# EAGLE design DoorLockShield (EAGLE 9.4.2)
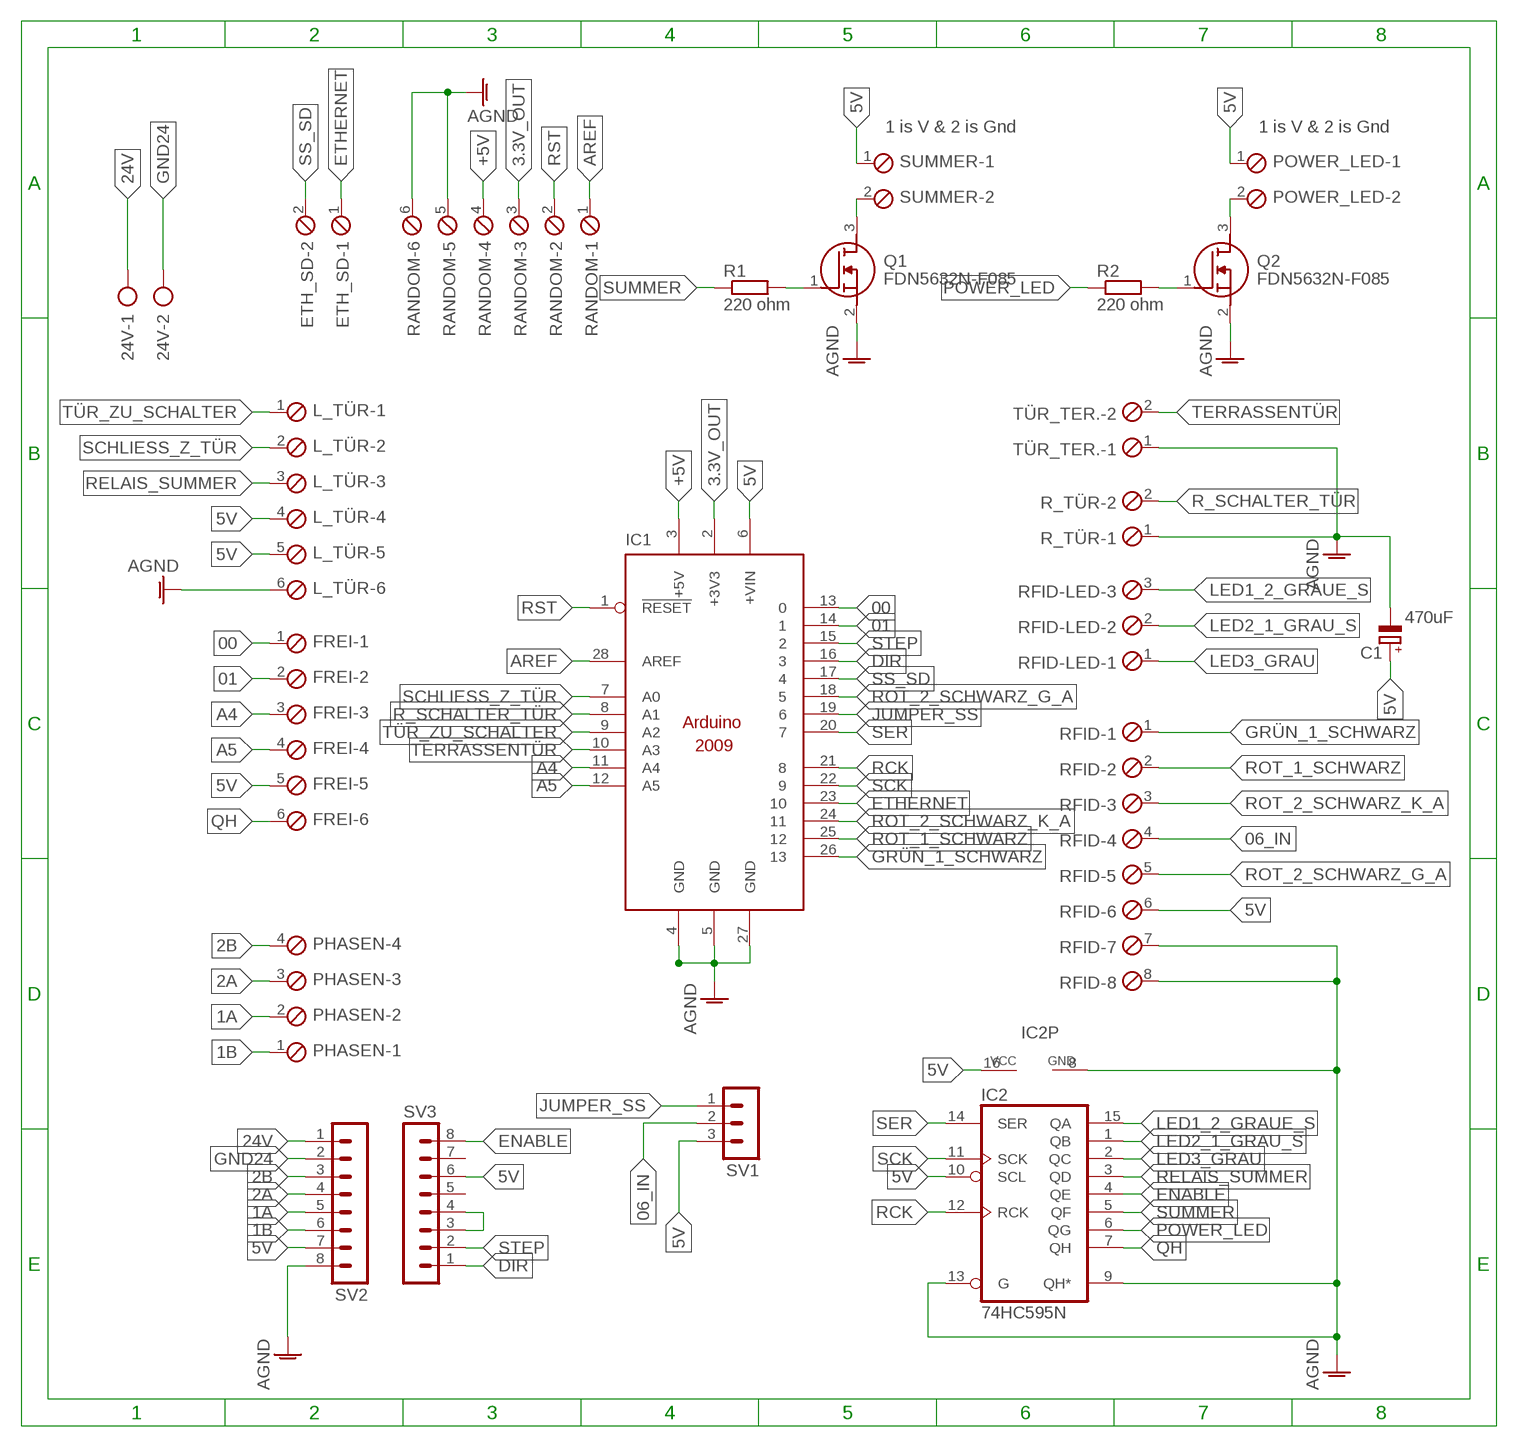
[diagram p0: schematic, sheet 1]

## Parts
24V  AK500/2  [AK500/2]
C1  470uF  CPOL-EUE7.5-16  [E7,5-16]
ETH_SD  MPT2  [2POL254]
FREI  MPT6  [6POL254]
IC1  ARDUINO2009_12  [ARDUINO2009_2]
IC2  74HC595N  [DIL16]
L_TÜR  MPT6  [6POL254]
PHASEN  MPT4  [4POL254]
POWER_LED  1 is V & 2 is Gnd  MPT2  [2POL254]
Q1  FDN5632N-F085  [SOT95P237X122-3N]
Q2  FDN5632N-F085  [SOT95P237X122-3N]
R1  220 ohm  R-EU_805R0805  [R0805]
R2  220 ohm  R-EU_805R0805  [R0805]
R_TÜR  MPT2  [2POL254]
RANDOM  MPT6  [6POL254]
RFID  MPT8  [8POL254]
RFID-LED  MPT3  [3POL254]
SUMMER  1 is V & 2 is Gnd  MPT2  [2POL254]
SV1  MA03-1  [MA03-1]
SV2  MA08-1  [MA08-1]
SV3  MA08-1  [MA08-1]
TÜR_TER.  MPT2  [2POL254]

## Nets
00: FREI.1 IC1.13
01: FREI.2 IC1.14
1A: PHASEN.2 SV2.5
1B: PHASEN.1 SV2.6
2A: PHASEN.3 SV2.4
2B: PHASEN.4 SV2.3
3.3V_OUT: IC1.2(+3V3) RANDOM.3
5V: C1.+ FREI.5 IC1.6(+VIN) IC2.10(SCL) IC2.16(VCC) L_TÜR.4 L_TÜR.5 POWER_LED.1 RFID.6 SUMMER.1 SV1.3 SV2.7 SV3.6
06_IN: RFID.4 SV1.2
24V: 24V.1 SV2.1
+5V: IC1.3(+5V) RANDOM.4
A4: FREI.3 IC1.11(A4)
A5: FREI.4 IC1.12(A5)
AGND: C1.- IC1.4(GND) IC1.5(GND) IC1.27(GND) IC2.8(GND) IC2.9(QH*) IC2.13(G) L_TÜR.6 Q1.2(S) Q2.2(S) R_TÜR.1 RANDOM.5 RANDOM.6 RFID.7 RFID.8 SV2.8 TÜR_TER..1
AREF: IC1.28(AREF) RANDOM.1
DIR: IC1.16 SV3.1
ENABLE: IC2.4(QE) SV3.8
ETHERNET: ETH_SD.1 IC1.23
GND24: 24V.2 SV2.2
GRÜN_1_SCHWARZ: IC1.26 RFID.1
JUMPER_SS: IC1.19 SV1.1
LED1_2_GRAUE_S: IC2.15(QA) RFID-LED.3
LED2_1_GRAU_S: IC2.1(QB) RFID-LED.2
LED3_GRAU: IC2.2(QC) RFID-LED.1
N$2: Q1.1(G) R1.2
N$3: Q2.1(G) R2.2
N$4: POWER_LED.2 Q2.3(D)
N$5: Q1.3(D) SUMMER.2
N$14: SV3.3 SV3.4
POWER_LED: IC2.6(QG) R2.1
QH: FREI.6 IC2.7(QH)
R_SCHALTER_TÜR: IC1.8(A1) R_TÜR.2
RCK: IC1.21 IC2.12(RCK)
RELAIS_SUMMER: IC2.3(QD) L_TÜR.3
ROT_1_SCHWARZ: IC1.25 RFID.2
ROT_2_SCHWARZ_G_A: IC1.18 RFID.5
ROT_2_SCHWARZ_K_A: IC1.24 RFID.3
RST: IC1.1(!RESET) RANDOM.2
SCHLIESS_Z_TÜR: IC1.7(A0) L_TÜR.2
SCK: IC1.22 IC2.11(SCK)
SER: IC1.20 IC2.14(SER)
SS_SD: ETH_SD.2 IC1.17
STEP: IC1.15 SV3.2
SUMMER: IC2.5(QF) R1.1
TERRASSENTÜR: IC1.10(A3) TÜR_TER..2
TÜR_ZU_SCHALTER: IC1.9(A2) L_TÜR.1
Unconnected: SV3.5 SV3.7

## Library data of the parts
24V = con-ptr500:AK500/2: CONNECTOR; OC_FARNELL: unknown; OC_NEWARK: unknown
C1 = rcl:CPOL-EU: POLARIZED CAPACITOR, European symbol; SPICEPREFIX: C
ETH_SD POWER_LED R_TÜR SUMMER TÜR_TER. = con-phoenix-254:MPT2: PHOENIX CONNECTOR; OC_FARNELL: unknown; OC_NEWARK: unknown
FREI L_TÜR RANDOM = con-phoenix-254:MPT6: PHOENIX CONNECTOR; OC_FARNELL: unknown; OC_NEWARK: unknown
IC1 = arduino:ARDUINO2009_1: The Arduino Duemilanove ("2009") is a microcontroller board based on the ATmega168 or ATmega328. - 14 digital input/output pins (of which 6 can be used as PWM outputs) - 6 analog inputs, a 16 MHz crystal oscillator - USB connection - power jack - ISP header - reset button It contains everything needed to support the microcontroller; simply connect it to a computer with a USB cable or power it with a AC-to-DC adapter or battery to get started http://arduino.cc/en/Main/ArduinoBoardDuemilanove
IC2 = 74xx-eu:74*595: 8-bit SHIFT REGISTER, output latch
PHASEN = con-phoenix-254:MPT4: PHOENIX CONNECTOR; OC_FARNELL: unknown; OC_NEWARK: unknown
Q1 Q2 = FDN5632N-F085:FDN5632N-F085: MOSFET Trans MOS N-Ch 60V 1.7A Source: Datasheet <https://www.onsemi.com/pub/Collateral/FDN5632N_F085-D.PDF>; DESCRIPTION: MOSFET Trans MOS N-Ch 60V 1.7A; HEIGHT: 1.22mm; MANUFACTURER_NAME: ON Semiconductor; MANUFACTURER_PART_NUMBER: FDN5632N-F085; MOUSER_PART_NUMBER: 512-FDN5632N-F085; MOUSER_PRICE-STOCK: https://www.mouser.com/Search/Refine.aspx?Keyword=512-FDN5632N-F085
R1 R2 = CommonParts:R-EU_805: RESISTOR, European symbol
RFID = con-phoenix-254:MPT8: PHOENIX CONNECTOR; OC_FARNELL: unknown; OC_NEWARK: unknown
RFID-LED = con-phoenix-254:MPT3: PHOENIX CONNECTOR; OC_FARNELL: unknown; OC_NEWARK: unknown
SV1 = con-lstb:MA03-1: PIN HEADER; OC_FARNELL: unknown; OC_NEWARK: unknown
SV2 SV3 = con-lstb:MA08-1: PIN HEADER; OC_FARNELL: unknown; OC_NEWARK: unknown

## Board
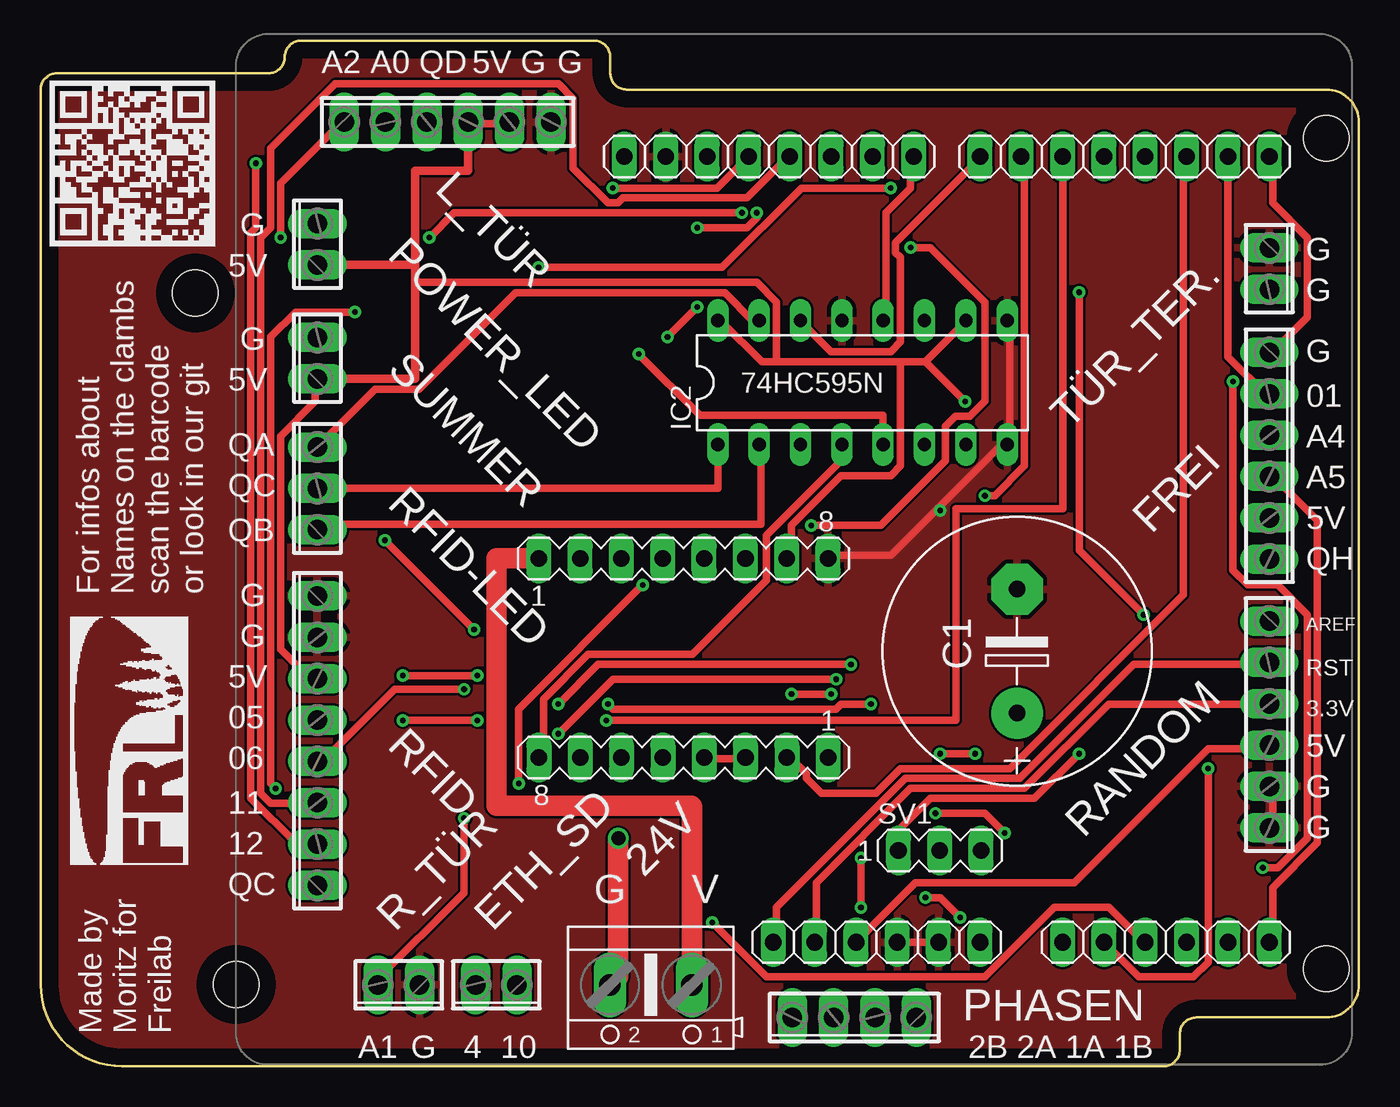
[diagram p1: board, top side]
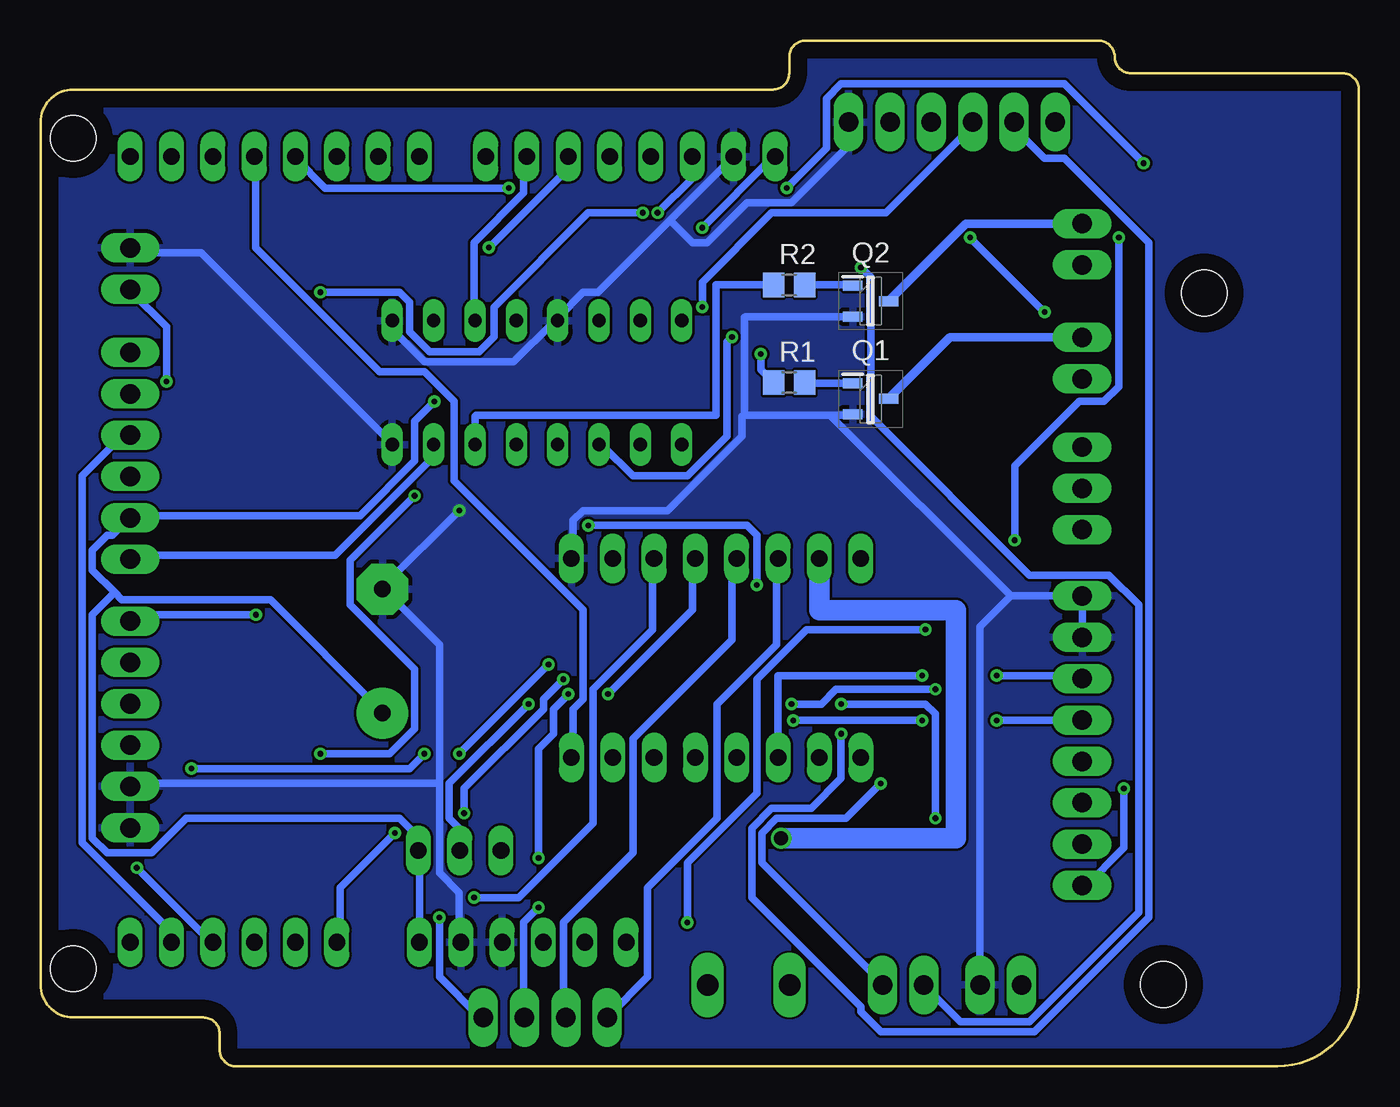
[diagram p2: board, bottom side, seen from below]

Size 81 x 63 mm. Coordinates in mm from the lower left corner, seen from the top.
Outline: 0,60 arc-90 1,61 14,61 arc90 15,62 arc-90 16,63 34,63 arc-90 35,62 35,61 arc90 36,60 79,60 arc-90 81,58 81,5 arc-90 79,3 71,3 arc90 70,2 70,1 arc-90 69,0 5,0 arc-90 0,5 0,60
Copper layers (1*16): Top 0.035mm / dielectric 1.5mm / Bottom 0.035mm
Design rules "default *": minimum track width 18mil, minimum drill 0.35mm, track to track 6mil, track to pad 6mil, pad to pad 6mil, via to via 6mil, smd to smd 6mil, copper to edge 40mil, drill to drill 6mil, minimum pad ring 10mil, minimum via ring 8mil, stop-mask expansion 4mil, vias tented up to drill 0mil, thermal gap 10mil
Holes 2.8 mm at 9.5,47.5 79,57 79,6 12.01,5.03

### Footprints (pad centres in the part's own frame; a part is rotated, then mirrored left to right if it is on the bottom)
AK500/2 = drill 1.321 long: 1 -2.515,0; 2 2.515,0
E7,5-16 = drill 1.016 pad 3.15: + -3.81,0 | drill 1.016 pad 3.15 octagon: - 3.81,0
2POL254 = drill 1.2 long: 1 -1.27,0; 2 1.27,0
6POL254 = drill 1.2 pad 1.778 long: 1 -6.35,0; 2 -3.81,0; 3 -1.27,0; 4 1.27,0; 5 3.81,0; 6 6.35,0
ARDUINO2009_2 = drill 1.016 long: 1 33.02,2.54; 2 35.56,2.54; 3 38.1,2.54; 4 40.64,2.54; 5 43.18,2.54; 6 45.72,2.54; 7 50.8,2.54; 8 53.34,2.54; 9 55.88,2.54; 10 58.42,2.54; 11 60.96,2.54; 12 63.5,2.54; 13 63.5,50.8; 14 60.96,50.8; 15 58.42,50.8; 16 55.88,50.8; 17 53.34,50.8; 18 50.8,50.8; 19 48.26,50.8; 20 45.72,50.8; 21 41.656,50.8; 22 39.116,50.8; 23 36.576,50.8; 24 34.036,50.8; 25 31.496,50.8; 26 28.956,50.8; 27 26.416,50.8; 28 23.876,50.8
DIL16 = drill 0.813 long: 1 -8.89,-3.81; 2 -6.35,-3.81; 3 -3.81,-3.81; 4 -1.27,-3.81; 5 1.27,-3.81; 6 3.81,-3.81; 7 6.35,-3.81; 8 8.89,-3.81; 9 8.89,3.81; 10 6.35,3.81; 11 3.81,3.81; 12 1.27,3.81; 13 -1.27,3.81; 14 -3.81,3.81; 15 -6.35,3.81; 16 -8.89,3.81
4POL254 = drill 1.2 long: 1 -3.81,0; 2 -1.27,0; 3 1.27,0; 4 3.81,0
SOT95P237X122-3N = smd 1.2 x 0.6: 1 -1.1,0.95; 2 -1.1,-0.95; 3 1.1,0
R0805 = smd 1.3 x 1.5: 1 -0.95,0; 2 0.95,0
8POL254 = drill 1.2 long: 1 -8.89,0; 2 -6.35,0; 3 -3.81,0; 4 -1.27,0; 5 1.27,0; 6 3.81,0; 7 6.35,0; 8 8.89,0
3POL254 = drill 1.2 long: 1 -2.54,0; 2 0,0; 3 2.54,0
MA03-1 = drill 1.016 long: 1 -2.54,0; 2 0,0; 3 2.54,0
MA08-1 = drill 1.016 long: 1 -8.89,0; 2 -6.35,0; 3 -3.81,0; 4 -1.27,0; 5 1.27,0; 6 3.81,0; 7 6.35,0; 8 8.89,0

### Placement (x,y rotation side)
24V  37.5,5 180 top
C1  60,25.5 90 top
ETH_SD  28,5 180 top
FREI  75.5,37.5 270 top
IC1  12,5.08 0 top
IC2  50.5,42 0 top
L_TÜR  25,58 0 top
PHASEN  50,3 180 top
POWER_LED  17,50.5 90 top
Q1  30,41 0 bottom
Q2  30,47 0 bottom
R1  35,42 0 bottom
R2  35,48 0 bottom
R_TÜR  22,5 180 top
RANDOM  75.5,21 270 top
RFID  17,20 90 top
RFID-LED  17,35.5 90 top
SUMMER  17,43.5 90 top
SV1  55.25,13.25 0 top
SV2  39.5,31.2 0 top
SV3  39.5,18.96 180 top
TÜR_TER.  75.5,49 270 top

### Tracks (layer width: path | path; a pad name or v marks a point on that pad's centre or on a via)
00
  Top 0.457: IC1.13 75.7,55.78 75.7,53.03 77.84,50.9 77.84,46.02 75.7,43.89 FREI.1
01
  Top 0.457: IC1.14 72.96,43.59 75.4,41.15 FREI.2
1A  (via drill 0.35)
  Top 0.457: v48.58,22.86 v46.14,22.86 | v50.41,9.75 v50.41,12.8
  Bottom 0.457: v46.14,22.86 40.96,28.04 40.96,31.09 SV2.5 | v48.58,22.86 49.49,21.95 49.49,20.42 50.41,19.51 v50.41,12.8 | v50.41,9.75 51.32,8.84 51.32,3.05 PHASEN.2
1B  (via drill 0.35)
  Top 0.457: v54.37,10.36 55.28,10.36 v56.5,9.14
  Bottom 0.457: v54.37,10.36 51.62,10.36 47.05,14.94 47.05,23.16 43.39,26.82 43.39,31.09 SV2.6 | v56.5,9.14 56.5,5.49 54.06,3.05 PHASEN.1
2A
  Bottom 0.457: SV2.4 38.52,31.09 38.52,26.21 44.61,20.12 44.61,13.11 48.88,8.84 48.88,3.05 PHASEN.3
2B
  Bottom 0.457: SV2.3 35.77,31.09 35.77,25.91 39.43,22.25 39.43,15.24 43.7,10.97 43.7,5.49 46.14,3.05 PHASEN.4
3.3V_OUT
  Top 0.457: IC1.2 47.66,7.62 47.66,11.28 53.45,17.07 60.46,17.07 65.65,22.25 75.4,22.25 RANDOM.3
5V  (via drill 0.35)
  Top 0.457: v22.25,24 v26.83,24 | 54.37,43.28 52.84,43.28 | 52.84,43.28 45.22,43.28 | 45.22,43.28 44.31,43.28 41.87,45.72 IC2.16 | 54.37,43.28 56.81,45.72 IC2.10 | 52.84,43.28 52.84,36.88 52.23,36.27 49.19,36.27 46.14,33.22 46.14,31.39 SV2.7 | L_TÜR.5 28.76,57.91 26.33,57.91 L_TÜR.4 | SUMMER.1 16.88,42.06 16.88,40.84 14.74,38.71 14.74,25.6 16.27,24.08 16.88,24.08 RFID.6 | 45.22,43.28 45.22,46.94 44,48.16 23,48.16 22.97,48.16 | 54.37,43.28 v56.81,40.84
  Top 0.508: SUMMER.1 23,42.23 23,48.16 23,49.23 | L_TÜR.4 26.27,55 23,55 23,49.23 | POWER_LED.1 23,49.23
  Bottom 0.457: RFID.6 17,24 v22.25,24 | v26.83,24 35.69,24 SV3.6 | IC1.6 57.72,13.11 SV1.3 58.02,13.41 58.02,14.33 58.94,15.24 72.05,15.24 74.18,13.11 76.92,13.11 77.84,14.02 77.84,27.74 76.47,29.11 | 76.47,29.11 76.01,28.65 66.86,28.65 60.16,21.95 C1.+ | 76.47,29.11 77.84,30.48 77.84,31.7 76.92,32.61 76.62,32.61 75.7,33.53 FREI.5 75.4,33.83 61.38,33.83 58.02,37.19 58.02,39.62 v56.81,40.84
06_IN  (via drill 0.35)
  Top 0.457: v51.01,22.25 49.19,22.25 48.88,21.95 35.16,21.95 v34.86,22.25 | v26.02,23.16 21.75,23.16 17.18,18.59 RFID.4
  Bottom 0.457: v51.01,22.25 55.89,17.37 55.89,15.24 55.28,14.63 55.28,13.41 SV1.2 | v34.86,22.25 33.03,22.25 32.12,23.16 v26.02,23.16
24V
  Top 1.27: 24V.1 40.02,15.98 40,16 28,16 28,31.2 SV2.1
+5V
  Top 0.457: IC1.3 53.76,11.28 63.51,11.28 71.74,19.51 75.4,19.51 RANDOM.4
A4
  Bottom 0.457: IC1.11 72.96,8.23 78.45,13.72 78.45,36.27 75.7,39.01 FREI.3
A5
  Top 0.457: IC1.12 75.7,7.62 75.7,10.97 78.45,13.72 78.45,33.53 75.7,36.27 FREI.4
AGND  (via drill 0.35)
  Top 0.457: RANDOM.6 75.7,14.94 75.7,17.07 RANDOM.5 | IC1.5 IC1.4 | IC2.9 59.55,45.72 59.55,38.41 IC2.8 59.24,38.41 55.13,34.29 | 55.13,34.29 52.23,31.39 48.58,31.39 SV2.8 | v55.28,34.14 55.13,34.29
  Bottom 0.457: 31.75,46.05 Q2.2 37.7,46.05 37.75,46 37.75,40 | 32.5,40 31.15,40 Q1.2 | 21.39,28.89 32.5,40 | 21.39,28.89 RFID.8 RFID.7 | R_TÜR.1 23.27,27.01 21.39,28.89 | 32.5,40 37.75,40 | 56.5,17.37 56.5,25.91 59.85,29.26 C1.- 59.85,29.57 v55.28,34.14 | 56.5,17.37 56.5,11.89 55.28,10.67 55.28,7.62 IC1.5 | 56.5,17.37 75.4,17.37 RANDOM.5 | IC2.9 59.24,45.72 59.24,45.11 57.41,43.28 51.93,43.28 49.49,45.72 IC2.13 49.19,46.02 47.66,47.55 46.75,47.55 42.33,51.97 | 42.33,51.97 IC1.27 | 42.33,51.97 40.96,50.6 40.04,50.6 37.6,53.03 34.86,53.03 31.51,56.39 31.51,57.91 L_TÜR.6 | TÜR_TER..1 75.4,49.99 71.13,49.99 59.55,38.41 IC2.8 | 37.75,40 37.91,39.93 37.91,38.71 42.48,34.14 47.66,34.14 48.27,33.53 48.27,31.39 SV2.8
  pour Top: 0,63 81,63 81,0 5,0 arc-90 0,5
  pour Bottom: 0,63 80,63 arc-90 81,62 81,2 arc-90 79,0 5,0 arc-90 0,5
AREF  (via drill 0.35)
  Top 0.457: v40.35,51.51 43.39,51.51 44,52.12 v44,52.43 | v63.82,47.55 63.82,31.7 v67.78,27.74
  Bottom 0.457: v40.35,51.51 36.08,55.78 IC1.28 | v44,52.43 47.36,52.43 53.15,46.63 53.15,44.81 54.06,43.89 57.11,43.89 58.33,45.11 58.33,46.94 58.94,47.55 v63.82,47.55 | v67.78,27.74 75.09,27.74 75.4,27.43 RANDOM.1
DIR
  Bottom 0.457: SV3.1 48.27,19.2 48.27,21.95 47.66,22.55 47.66,28.04 55.59,35.97 55.59,40.84 57.41,42.67 60.16,42.67 67.78,50.29 67.78,55.78 IC1.16
ENABLE
  Top 0.457: IC2.4 49.19,38.1 49.19,37.19 44.61,32.61 44.61,29.87 40.04,25.3 33.64,25.3 30.9,22.55 30.9,19.2 SV3.8
ETHERNET  (via drill 0.35)
  Top 0.457: v53.45,50.29 54.67,50.29 58.02,46.94 58.02,40.84 57.11,39.93 56.2,39.93 55.59,39.32 55.59,37.19 51.62,33.22 v47.36,33.22 | v36.99,29.57 29.37,21.95 v29.37,17.37
  Bottom 0.457: IC1.23 48.58,55.17 v53.45,50.29 | v47.36,33.22 37.6,33.22 36.99,32.61 v36.99,29.57 | v29.37,17.37 31.51,15.24 35.77,15.24 36.69,14.33 36.69,12.5 29.37,5.18 ETH_SD.1
GND24  (via drill 0.85)
  Top 1.27: v35.5,14 35.48,14 35.48,5.5 24V.2
  Bottom 1.27: v35.5,14 24.75,14 24.75,28 33.15,28 SV2.2
GRÜN_1_SCHWARZ  (via drill 0.35)
  Top 0.457: v43.09,52.43 25.41,52.43 v23.89,50.9 | v19.32,46.33 15.66,46.33 14.13,44.81 14.13,17.37 v14.44,17.07
  Bottom 0.457: IC1.26 40.96,54.56 v43.09,52.43 | v19.32,46.33 v23.89,50.9 | v14.44,17.07 14.44,13.41 16.88,10.97 RFID.1
JUMPER_SS  (via drill 0.35)
  Top 0.457: v63.82,19.2 61.07,16.46 54.67,16.46 52.84,14.63 52.84,13.41 SV1.1 | v58.02,35.05 58.63,35.05 60.46,36.88 60.46,55.78 IC1.19
  Bottom 0.457: v63.82,19.2 59.55,19.2 58.02,20.73 58.02,24.38 61.99,28.35 61.99,31.09 v58.02,35.05
LED1_2_GRAUE_S
  Top 0.457: RFID-LED.3 20.55,41.59 23.26,41.59 29.18,47.51 42.04,47.51 43.74,45.81 IC2.15
LED2_1_GRAU_S
  Top 0.457: RFID-LED.2 41.61,35.5 IC2.1
LED3_GRAU
  Top 0.457: RFID-LED.1 17,33.31 44.25,33.31 44.25,38.19 IC2.2
N$2
  Bottom 0.457: Q1.1 34,41.95 R1.2
N$3
  Bottom 0.457: Q2.1 31.15,48 R2.2
N$4
  Bottom 0.508: POWER_LED.2 24.13,51.77 Q2.3
N$5
  Bottom 0.508: SUMMER.2 25.13,44.77 Q1.3
N$14
  Top 0.457: SV3.4 40.96,18.9 43.09,18.9 SV3.3
POWER_LED
  Bottom 0.457: R2.1 39.5,48 39.5,40 54.25,40 54.31,39.94 IC2.6
QH
  Bottom 0.457: IC2.7 57.11,38.1 57.11,37.19 62.9,31.39 75.4,31.39 FREI.6
R_SCHALTER_TÜR  (via drill 0.35)
  Top 0.457: IC1.8 67.47,5.49 70.83,5.49 71.74,6.4 v71.74,18.29 | v55.28,19.2 v57.41,19.2 | v49.8,24.69 34.25,24.69 v31.81,22.25 | v26.02,15.24 26.02,10.67 20.53,5.18 R_TÜR.2
  Bottom 0.457: v71.74,18.29 58.33,18.29 v57.41,19.2 | v49.8,24.69 v55.28,19.2 | v31.81,22.25 26.63,22.25 26.02,21.64 v26.02,15.24
RCK
  Top 0.457: IC2.12 51.93,46.02 51.93,52.43 53.45,53.95 53.45,55.78 IC1.21
RELAIS_SUMMER  (via drill 0.35)
  Top 0.457: v40.35,46.63 v38.52,44.81
  Bottom 0.457: v38.52,44.81 38.82,44.5 38.82,38.71 41.26,36.27 44.61,36.27 46.44,38.1 IC2.3 | v40.35,46.63 40.35,48.16 36.08,52.43 29.07,52.43 23.58,57.91 L_TÜR.3
ROT_1_SCHWARZ  (via drill 0.35)
  Top 0.457: IC1.25 41.57,53.95 v35.16,53.95 | v13.22,55.47 13.22,51.51 12.91,51.21 12.91,16.46 15.66,13.72 16.88,13.72 RFID.2
  Bottom 0.457: v35.16,53.95 32.73,56.39 32.73,59.44 31.81,60.35 18.1,60.35 v13.22,55.47
ROT_2_SCHWARZ_G_A  (via drill 0.35)
  Top 0.457: v34.75,21.25 56.25,21.25 56.25,34.25 62.8,34.25 IC1.18 | v22.25,21.25 v26.83,21.25
  Bottom 0.457: RFID.5 22.25,21.27 v22.25,21.25 | v26.83,21.25 v34.75,21.25
ROT_2_SCHWARZ_K_A
  Top 0.457: IC1.24 45.83,55.78 43.39,53.34 35.77,53.34 35.47,53.03 34.86,53.03 32.73,55.17 32.73,59.44 31.81,60.35 18.1,60.35 14.13,56.39 14.13,51.51 13.52,50.9 13.52,16.76 14.13,16.15 16.88,16.15 RFID.3
RST
  Top 0.457: IC1.1 45.22,7.62 45.22,9.75 53.15,17.68 60.16,17.68 67.17,24.69 75.4,24.69 RANDOM.2
SCHLIESS_Z_TÜR  (via drill 0.35)
  Top 0.457: v59.24,14.33 58.02,15.54 v54.98,15.54 | v48.88,23.77 35.16,23.77 v31.81,20.42
  Bottom 0.457: v59.24,14.33 62.6,10.97 62.6,7.62 IC1.7 | v54.98,15.54 54.98,17.07 50.1,21.95 50.1,22.55 v48.88,23.77 | v31.81,20.42 31.81,17.68 33.64,15.85 36.08,15.85 37.3,14.63 37.3,10.36 30.59,3.66 30.59,3.35 29.37,2.13 19.93,2.13 12.91,9.14 12.91,50.6 18.1,55.78 19.32,55.78 21.45,57.91 L_TÜR.2
SCK
  Bottom 0.457: IC2.11 54.37,46.02 54.37,50.6 51.32,53.65 51.32,55.78 IC1.22
SER
  Top 0.457: IC2.14 46.75,45.72 48.58,43.89 52.23,43.89 52.84,44.5 52.84,49.68 52.54,49.99 52.54,50.6 57.72,55.78 IC1.20
SS_SD  (via drill 0.35)
  Top 0.457: v52.23,53.95 46.75,53.95 41.87,49.07 v30.59,49.07
  Bottom 0.457: v52.23,53.95 63.51,53.95 65.34,55.78 IC1.17 | v30.59,49.07 29.98,48.46 29.98,39.93 20.23,30.18 15.35,30.18 13.52,28.35 13.52,9.45 20.23,2.74 24.5,2.74 26.63,4.88 ETH_SD.2
STEP
  Top 0.457: SV3.2 46.14,18.9 47.05,17.98 47.05,17.68 47.97,16.76 51.32,16.76 52.84,18.29 59.55,18.29 70.22,28.96 70.22,55.78 IC1.15
SUMMER  (via drill 0.35)
  Top 0.457: v36.75,43.75 40.5,40 51.75,40 51.77,39.98 IC2.5
  Bottom 0.457: R1.1 36.75,42.8 v36.75,43.75
TERRASSENTÜR  (via drill 0.35)
  Top 0.457: v75.09,12.19 76.01,12.19 77.84,14.02 77.84,27.74 76.01,29.57 74.18,29.57 73.27,30.48 v73.27,42.06
  Bottom 0.457: v75.09,12.19 70.52,7.62 IC1.10 | v73.27,42.06 73.27,45.41 75.4,47.55 TÜR_TER..2
TÜR_ZU_SCHALTER  (via drill 0.35)
  Top 0.457: v41.26,8.84 44.61,5.49 58.02,5.49 62.29,9.75 65.65,9.75 67.78,7.62 IC1.9 | v21.14,32.31 v26.63,26.82 | v14.74,50.9 14.74,54.25 18.4,57.91 L_TÜR.1
  Bottom 0.457: v41.26,8.84 41.26,12.5 36.99,16.76 36.99,23.77 33.95,26.82 v26.63,26.82 | v21.14,32.31 21.14,36.88 17.18,40.84 15.66,40.84 14.74,41.76 v14.74,50.9

### Text on the board
tNames: A2 | A0 | QD | 5V | G | G | G | G | 5V | G | G | G | 5V | 01 | QA | A4 | A5 | QC | 5V | QB | QH | For infos about / Names on the clambs / scan the barcode / or look in our git | G | AREF | G | RST | 5V | 3.3V | 05 | 5V | 06 | 11 | G | G | 12 | QC | G | V | Made by / Moritz for / Freilab | A1 | G | 4 | 10 | 2B 2A 1A 1B